# Altium schematic sheet Switch.SchDoc
size A4
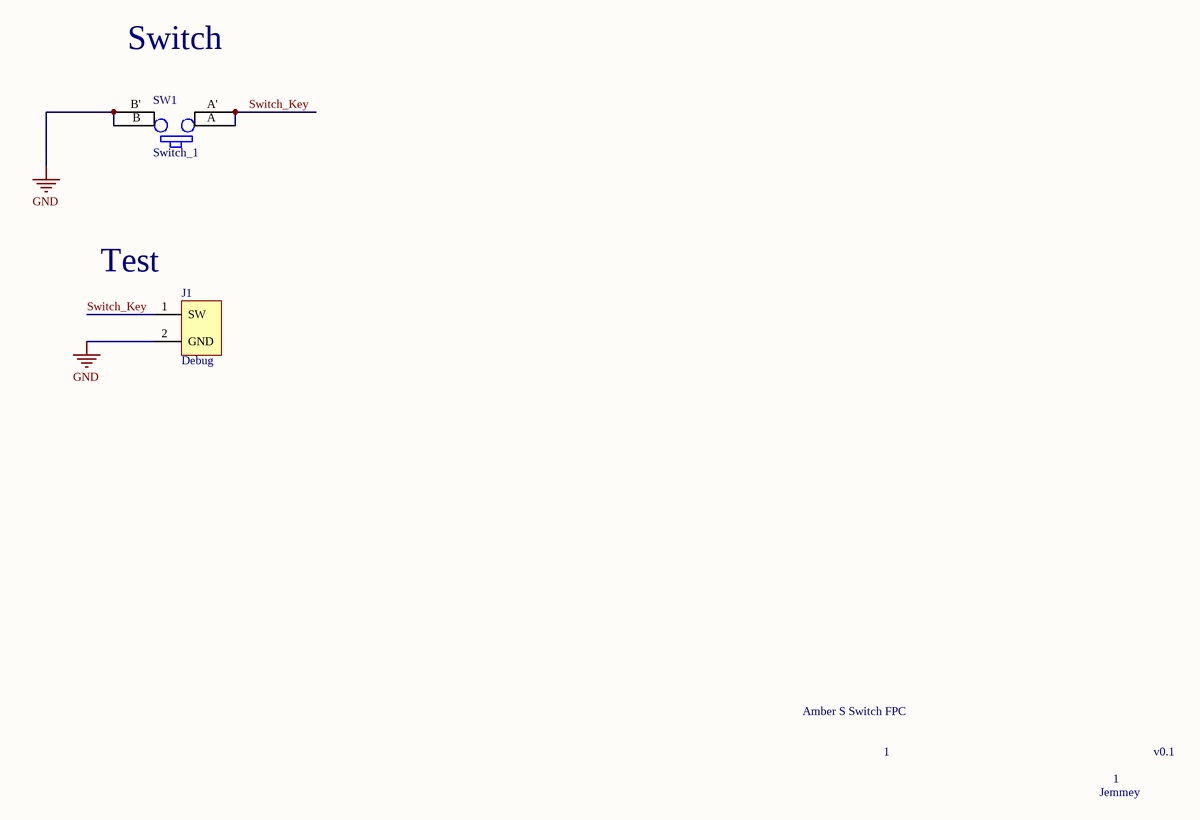
[diagram p0: Switch.SchDoc]

## Parts
J1  Debug  [Debug-2Pin]
SW1  Switch_1  [EVQPLD]

## Nets
GND: J1.2(GND) SW1.B SW1.B'
Switch_Key: J1.1(SW) SW1.A SW1.A'

## Notes on the sheet
- Switch
- (near J1) Test
- Amber S Switch FPC
- 1
- v0.1
- Jemmey

## Library data of the parts
J1 = Debug_1: 厂家：暂定，型号：暂定
SW1 = Switch_1: 厂家：松下，型号：EVQPLMA15